# EAGLE design Clover (EAGLE 7.5.0)
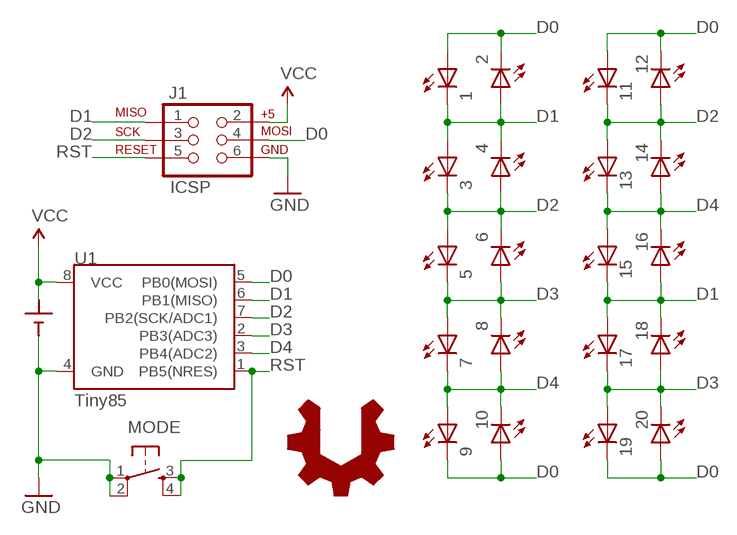
[diagram p0: schematic, sheet 1]

## Parts
1  LED5MM  [LED5MM]
2  LED5MM  [LED5MM]
3  LED5MM  [LED5MM]
4  LED5MM  [LED5MM]
5  LED5MM  [LED5MM]
6  LED5MM  [LED5MM]
7  LED5MM  [LED5MM]
8  LED5MM  [LED5MM]
9  LED5MM  [LED5MM]
10  LED5MM  [LED5MM]
11  LED5MM  [LED5MM]
12  LED5MM  [LED5MM]
13  LED5MM  [LED5MM]
14  LED5MM  [LED5MM]
15  LED5MM  [LED5MM]
16  LED5MM  [LED5MM]
17  LED5MM  [LED5MM]
18  LED5MM  [LED5MM]
19  LED5MM  [LED5MM]
20  LED5MM  [LED5MM]
BATT  CR2032  BATTCR2032_THRU  [CR2032-THRU]
J1  ICSP  AVR_SPI_PRG_6LABELED  [2X3-NS]
MODE  TAC_SWITCHPTH  [TACTILE-PTH]
U1  Tiny85  ATTINY45TINY85-20-DIP  [DIP08]
U$1  USER_HACKABLE  [USER_HACKABLE]

## Nets
D0: 1.A 2.K(C) 9.K(C) 10.A 11.A 12.K(C) 19.K(C) 20.A J1.4(MOSI) U1.5(PB0(MOSI))
D1: 1.K(C) 2.A 3.A 4.K(C) 15.K(C) 16.A 17.A 18.K(C) J1.1(MISO) U1.6(PB1(MISO))
D2: 3.K(C) 4.A 5.A 6.K(C) 11.K(C) 12.A 13.A 14.K(C) J1.3(SCK) U1.7(PB2(SCK/ADC1))
D3: 5.K(C) 6.A 7.A 8.K(C) 17.K(C) 18.A 19.A 20.K(C) U1.2(PB3(ADC3))
D4: 7.K(C) 8.A 9.A 10.K(C) 13.K(C) 14.A 15.A 16.K(C) U1.3(PB4(ADC2))
GND: BATT.- J1.6(GND) MODE.1 MODE.2 U1.4(GND)
RST: J1.5(RST) MODE.3 MODE.4 U1.1(PB5(NRES))
VCC: BATT.+1(+) J1.2(V+) U1.8(VCC)

## Library data of the parts
1-20 = barbary_enterprises:LED: LEDs Standard schematic elements and footprints for 5mm, 3mm, 1206, and 0603 sized LEDs. 5mm - Spark Fun Electronics SKU : COM-00529 (and others)
BATT = battery:BATT
J1 = barbary_enterprises:AVR_SPI_PRG_6: AVR ISP 6 Pin This is the reduced ISP connector for AVR programming. Common on Arduino. This footprint will take up less PCB space and can be used with a 10-pin to 6-pin adapter such as SKU: BOB-08508
MODE = barbary_enterprises:TAC_SWITCH: Momentary Switch Button commonly used for reset or general input. Spark Fun Electronics SKU : COM-00097 SMT- SWCH-08247
U1 = SparkFun-DigitalIC:ATTINY45: Atmel 8-pin 2/4/8kB flash uC; PROD_ID: IC-09445; VALUE: TINY85-20-DIP
U$1 = logo:USER_HACKABLE

## Board
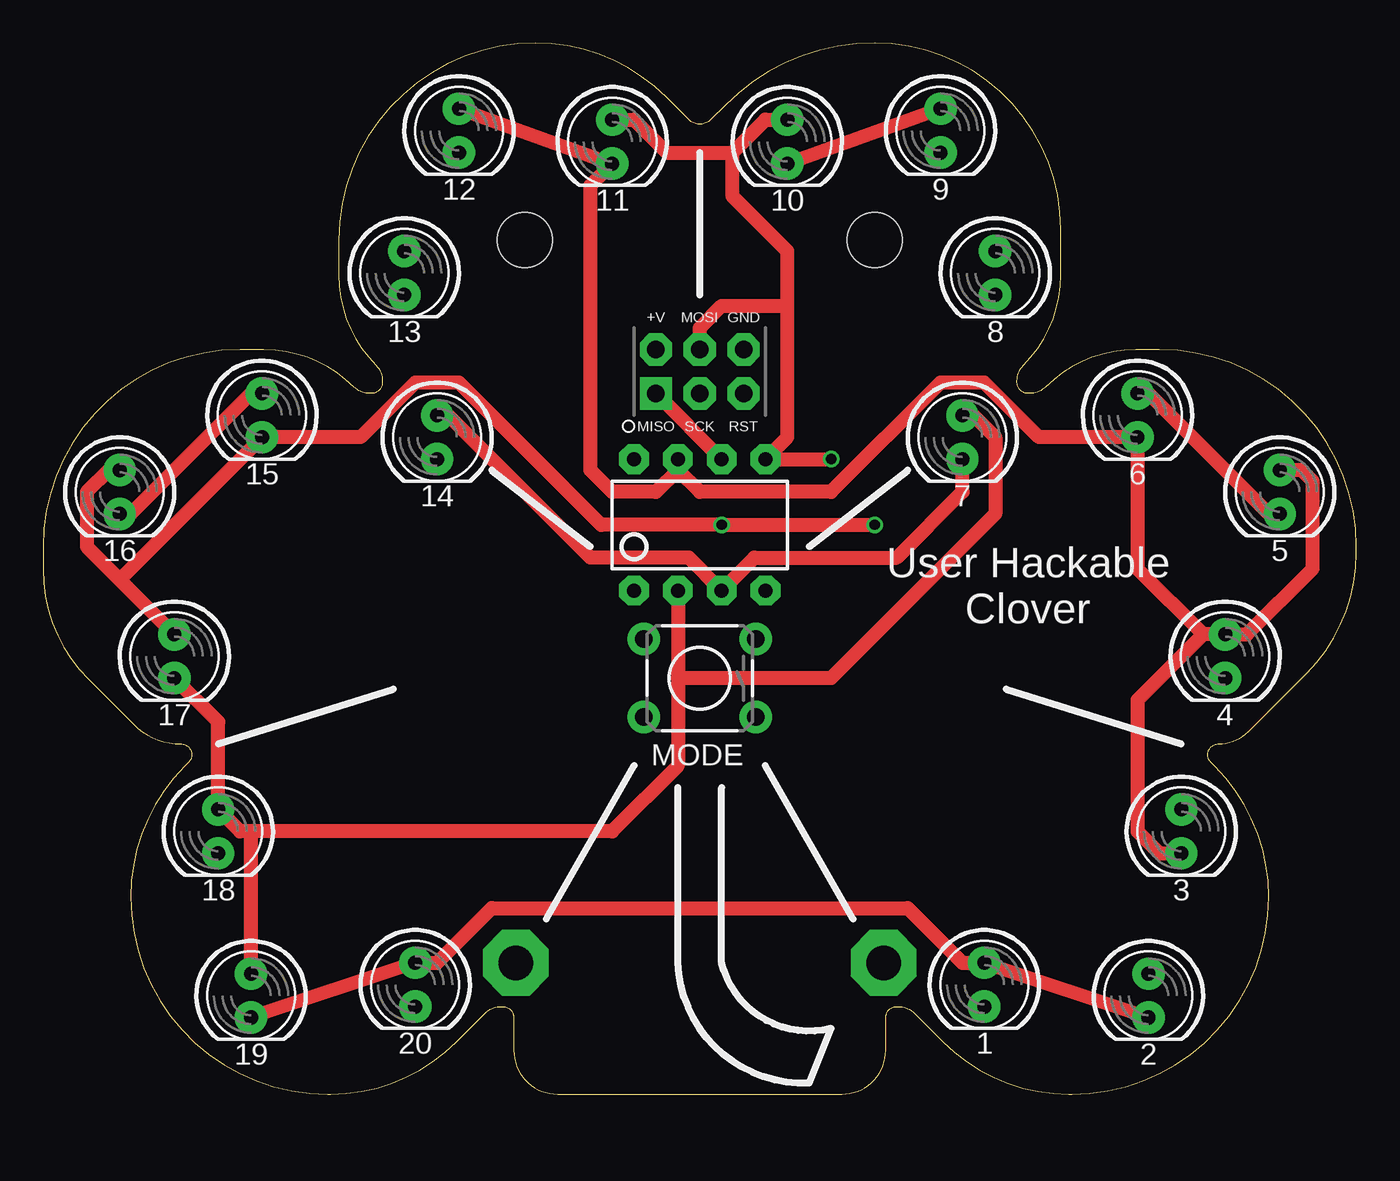
[diagram p1: board, top side]
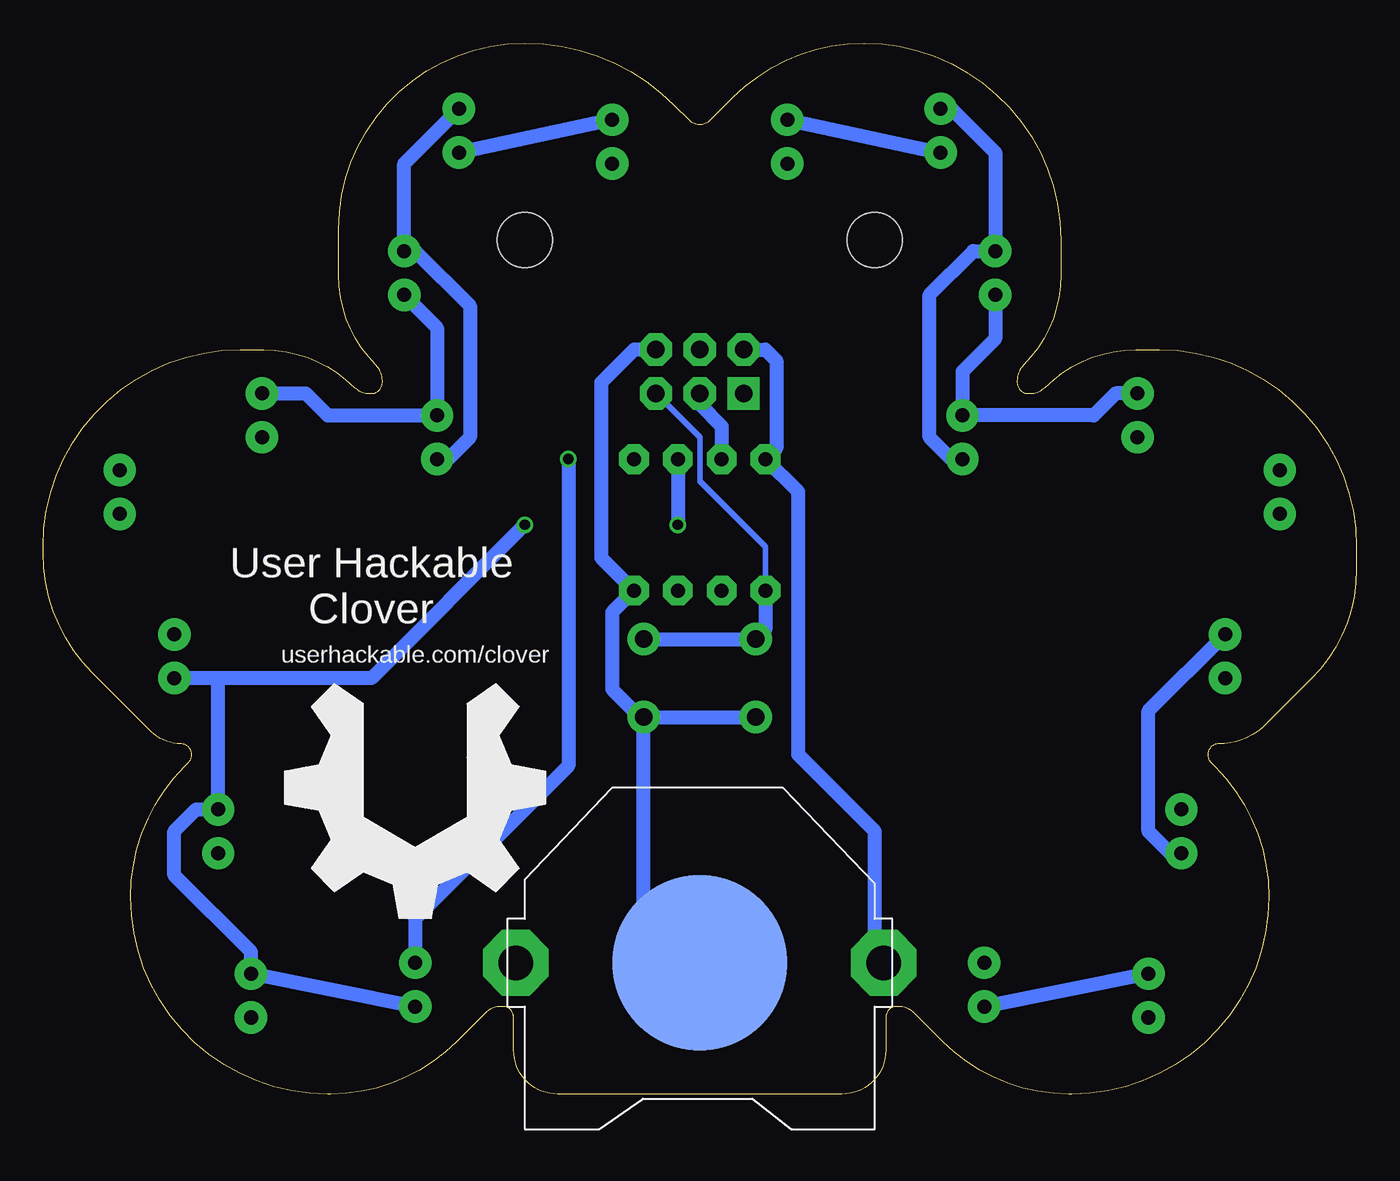
[diagram p2: board, bottom side, seen from below]

Size 76.2 x 60.96 mm. Coordinates in mm from the lower left corner, seen from the top.
Outline: 8.44,19.24 8.22,19.02 arc45 5.08,11.43 arc90 16.51,0 16.67,0 arc45 23.98,3.03 25.66,4.71 arc-45 26.56,5.08 26.67,5.08 arc-90 27.3,4.45 27.3,2.54 arc90 29.84,0 46.35,0 arc90 48.9,2.54 48.9,4.45 arc-90 49.53,5.08 49.64,5.08 arc-45 50.54,4.71 52.22,3.03 arc45 59.53,0 59.69,0 arc90 71.12,11.43 arc45 67.98,19.02 67.76,19.24 arc-135 68.21,20.32 arc45 69.93,21.03 73.31,24.41 arc45 76.2,31.4 76.2,31.75 arc90 64.77,43.18 63.39,43.18 arc45 58.16,41.01 arc-45 57.26,40.64 57.15,40.64 arc-90 56.52,41.27 56.52,41.38 arc-45 56.89,42.28 arc45 59.05,47.52 59.05,50.16 arc90 48.26,60.96 arc45 39.59,57.37 38.73,56.52 arc-90 37.47,56.52 36.16,57.82 arc45 28.57,60.96 arc90 17.14,49.53 17.14,47.52 arc45 19.31,42.28 arc-45 19.68,41.38 19.68,41.27 arc-90 19.05,40.64 18.94,40.64 arc-45 18.04,41.01 arc45 12.81,43.18 11.43,43.18 arc90 0,31.75 0,30.43 arc45 2.64,24.07 5.24,21.46 arc45 7.99,20.32 arc-135 8.44,19.24
Copper layers (1*16): Top 0.0356mm / dielectric 1.5011mm / Bottom 0.0356mm
Design rules "LaenPCBOrder": minimum track width 6mil, minimum drill 13mil, track to track 6mil, track to pad 6mil, pad to pad 6mil, via to via 6mil, smd to smd 6mil, copper to edge 15mil, drill to drill 6mil, minimum pad ring 7mil, minimum via ring 7mil, stop-mask expansion 3mil, vias tented up to drill 0mil, thermal gap 10mil
Holes 3.17 mm at 27.94,49.53 48.26,49.53

### Footprints (pad centres in the part's own frame; a part is rotated, then mirrored left to right if it is on the bottom)
LED5MM = drill 0.813 pad 1.88: A -1.27,0; K 1.27,0
CR2032-THRU = drill 2 pad 3.81 octagon: +1 -10.668,0; +2 10.668,0 | smd 10.16 x 10.16: - 0,0
2X3-NS = drill 1.016 pad 1.88 square: 1 -2.54,-1.27 | drill 1.016 pad 1.88 octagon: 2 -2.54,1.27; 3 0,-1.27; 4 0,1.27; 5 2.54,-1.27; 6 2.54,1.27
TACTILE-PTH = drill 1.016 pad 1.88: 1 -3.251,2.261; 2 3.251,2.261; 3 -3.251,-2.261; 4 3.251,-2.261
DIP08 = drill 0.813 pad 1.727 octagon: 1 -3.81,-3.81; 2 -1.27,-3.81; 3 1.27,-3.81; 4 3.81,-3.81; 5 3.81,3.81; 6 1.27,3.81; 7 -1.27,3.81; 8 -3.81,3.81

### Placement (x,y rotation side)
1  54.61,6.35 270 top
2  64.14,5.71 270 top
3  66.04,15.24 270 top
4  68.58,25.4 270 top
5  71.75,34.92 270 top
6  63.5,39.37 270 top
7  53.34,38.1 270 top
8  55.24,47.62 270 top
9  52.07,55.88 270 top
10  43.18,55.24 270 top
11  33.02,55.24 270 top
12  24.13,55.88 270 top
13  20.95,47.62 270 top
14  22.86,38.1 270 top
15  12.7,39.37 270 top
16  4.45,34.92 270 top
17  7.62,25.4 270 top
18  10.16,15.24 270 top
19  12.06,5.71 270 top
20  21.59,6.35 270 top
BATT  38.1,7.62 180 bottom
J1  38.1,41.91 0 top
MODE  38.1,24.13 180 top
U1  38.1,33.02 0 top
U$1  54.61,17.78 0 bottom

### Tracks (layer width: path | path; a pad name or v marks a point on that pad's centre or on a via)
D0  (via drill 0.6)
  Top 0.813: 2.K 1.A 53.34,7.62 50.16,10.79 26.04,10.79 22.86,7.62 20.A 19.K | v45.72,36.83 U1.5 43.18,38.1 43.18,45.72 | 11.A 34.29,56.52 36.2,54.61 40.01,54.61 | 40.01,54.61 41.91,56.52 10.A | 43.18,45.72 43.18,48.9 40.01,52.07 40.01,54.61 | J1.4 38.1,44.45 39.37,45.72 43.18,45.72
  Bottom 0.813: 11.A 12.K | 10.A 9.K | v45.72,36.83 45.72,19.05 54.61,10.16 1.A
D1  (via drill 0.6)
  Top 0.813: 16.A 3.81,36.2 2.54,34.92 2.54,31.75 4.45,29.84 | 4.45,29.84 17.A | 4.45,29.84 15.K 18.41,38.1 21.59,41.27 24.13,41.27 32.38,33.02 v39.37,33.02 v48.26,33.02 | J1.1 U1.6
  Bottom 0.813: 1.K 2.A 64.14,8.26 68.58,12.7 68.58,15.24 67.31,16.51 3.A 66.04,24.13 | 18.K 10.79,13.97 12.06,15.24 12.06,22.23 17.A | U1.6 v39.37,33.02 | v48.26,33.02 57.15,24.13 66.04,24.13 | 66.04,24.13 4.K
D2
  Top 0.813: 12.A 11.K 31.75,52.7 31.75,36.2 33.02,34.92 35.56,34.92 36.83,36.2 | U1.7 36.83,36.2 | 36.83,36.2 38.1,34.92 45.72,34.92 52.07,41.27 54.61,41.27 57.78,38.1 6.K 63.5,30.48 67.31,26.67 | 67.31,26.67 4.A 69.85,26.67 73.66,30.48 73.66,35.56 73.03,36.2 5.A | 67.31,26.67 63.5,22.86 63.5,15.24 64.77,13.97 3.K
  Bottom 0.813: 14.K 23.5,36.83 24.77,38.1 24.77,46.35 22.23,48.9 13.A 20.95,54.61 23.5,57.15 12.A | J1.3 38.1,40.01 36.83,38.73 U1.7
D3
  Top 0.813: U1.2 36.83,24.13 | 36.83,24.13 36.83,19.05 33.02,15.24 12.06,15.24 | 12.06,15.24 11.43,15.24 18.A 10.16,21.59 17.K | 19.A 12.06,15.24 | 7.A 53.98,39.37 55.24,38.1 55.24,33.66 45.72,24.13 36.83,24.13 | 5.K 71.12,33.66 64.14,40.64 6.A
  Bottom 0.813: 19.A 20.K | 6.A 60.96,40.64 59.69,39.37 7.A 53.34,44.45 8.K
D4
  Top 0.813: 14.A 23.5,39.37 31.75,31.11 37.47,31.11 U1.3 41.27,31.11 49.53,31.11 53.34,34.92 7.K | 16.K 5.08,33.66 12.06,40.64 15.A | 9.A 10.K
  Bottom 0.813: 15.A 13.97,40.64 15.24,39.37 14.A 22.86,41.91 20.95,43.81 13.K | 7.K 52.7,36.83 51.44,38.1 51.44,45.72 54.61,48.9 8.A 55.24,53.98 9.A
GND
  Bottom 0.813: MODE.1 41.55,21.87 43.18,23.5 43.18,27.94 U1.4 43.81,31.11 43.81,41.27 41.91,43.18 J1.6 | MODE.1 MODE.2 | BATT.- 41.35,10.87 MODE.1
RST
  Bottom 0.305: J1.5 38.1,38.1 38.1,35.56 34.29,31.75 U1.1
  Bottom 0.813: MODE.3 MODE.4 34.29,26.95 U1.1
VCC
  Bottom 0.813: BATT.+1 27.94,8.13 27.94,15.24 32.38,19.68 32.38,34.92 U1.8 33.66,37.47 33.66,42.55 34.29,43.18 J1.2

### Text on the board
tPlace: User Hackable / Clover
bPlace: User Hackable / Clover | userhackable.com/clover